# EAGLE design BB-GPS (EAGLE 6.3)
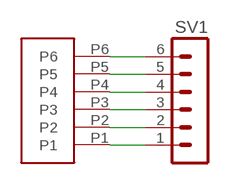
[diagram p0: schematic, sheet 1]

## Parts
SV1  MA06-1  [MA06-1]
U$1  6PADBOISBLAS  [6PAD]

## Nets
N$1: SV1.1 U$1.P1
N$2: SV1.2 U$1.P2
N$3: SV1.3 U$1.P3
N$4: SV1.4 U$1.P4
N$5: SV1.5 U$1.P5
N$6: SV1.6 U$1.P6

## Library data of the parts
SV1 = con-lstb:MA06-1: PIN HEADER; OC_FARNELL: unknown; OC_NEWARK: unknown
U$1 = konektor:6PAD: Pad untuk 6 konektor

## Board
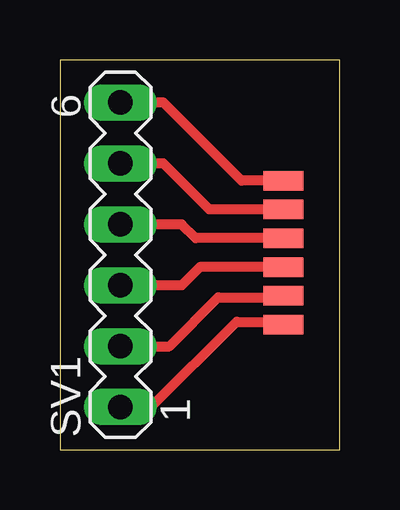
[diagram p1: board, top side]

Size 11.68 x 16.26 mm. Coordinates in mm from the lower left corner, seen from the top.
Outline: 0,0 11.68,0 11.68,16.26 0,16.26 0,0
Copper layers (1*16): Top 0.035mm / dielectric 1.5mm / Bottom 0.035mm
Design rules "default": minimum track width 10mil, minimum drill 24mil, track to track 8mil, track to pad 8mil, pad to pad 8mil, via to via 8mil, smd to smd 8mil, copper to edge 40mil, drill to drill 8mil, minimum pad ring 10mil, minimum via ring 8mil, stop-mask expansion 4mil, vias tented up to drill 0mil, thermal gap 10mil

### Footprints (pad centres in the part's own frame; a part is rotated, then mirrored left to right if it is on the bottom)
MA06-1 = drill 1.016 long: 1 -6.35,0; 2 -3.81,0; 3 -1.27,0; 4 1.27,0; 5 3.81,0; 6 6.35,0
6PAD = smd 1.676 x 0.813: P1 -1.2,2.4; P2 -1.2,1.2; P3 -1.2,0; P4 -1.2,-1.2; P5 -1.2,-2.4; P6 -1.2,-3.6

### Placement (x,y rotation side)
SV1  2.52,8.13 90 top
U$1  8.13,7.62 180 top

### Tracks (layer width: path | path; a pad name or v marks a point on that pad's centre or on a via)
N$1
  Top 0.406: SV1.1 3.81,1.78 7.37,5.33 9.21,5.33 U$1.P1
N$2
  Top 0.406: SV1.2 4.57,4.32 6.6,6.35 9.26,6.35 U$1.P2
N$3
  Top 0.406: U$1.P3 5.84,7.62 5.08,6.86 SV1.3
N$4
  Top 0.406: U$1.P4 5.66,8.82 5.08,9.4 SV1.4
N$5
  Top 0.406: U$1.P5 6.24,10.02 4.32,11.94 SV1.5
N$6
  Top 0.406: U$1.P6 7.58,11.22 4.32,14.48 SV1.6